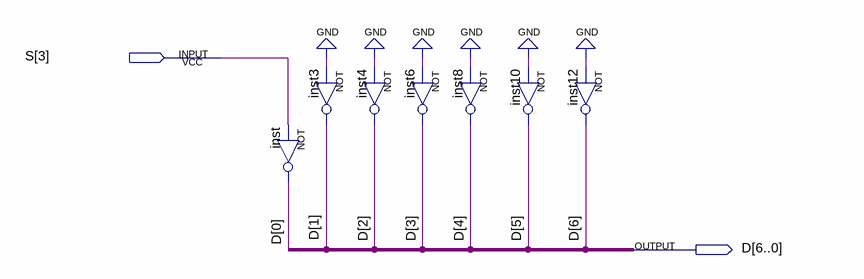
[diagram p0: schematic sheet]
// Quartus schematic Display2ULA.bdf as structural Verilog: 7 symbols, 2 pins
module Display2ULA (
  input  [3:3] S,
  output [6:0] D
);

  not inst3 (D[1], 1'b0);
  not inst (D[0], S[3]);
  not inst4 (D[2], 1'b0);
  not inst6 (D[3], 1'b0);
  not inst8 (D[4], 1'b0);
  not inst10 (D[5], 1'b0);
  not inst12 (D[6], 1'b0);
endmodule
